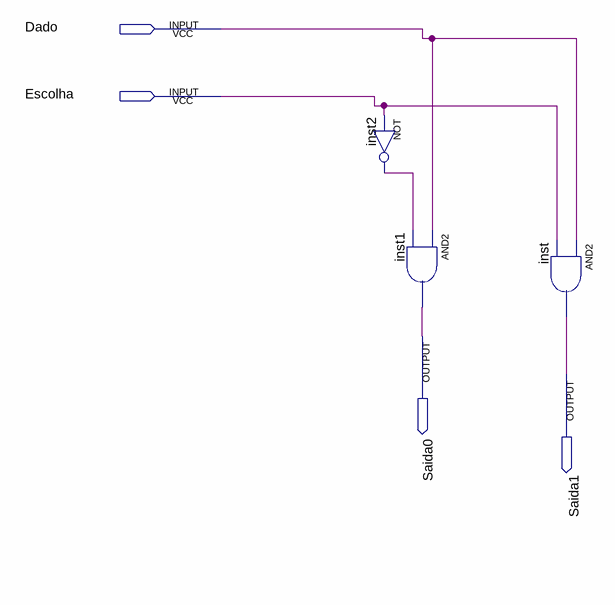
[diagram p0: schematic sheet]
// Quartus schematic Demux2.bdf as structural Verilog: 3 symbols, 4 pins
module Demux2 (
  input  Dado,
  input  Escolha,
  output Saida0,
  output Saida1
);

  wire inst2_out;

  not inst2 (inst2_out, Escolha);
  and inst1 (Saida0, Dado, inst2_out);
  and inst (Saida1, Dado, Escolha);
endmodule
